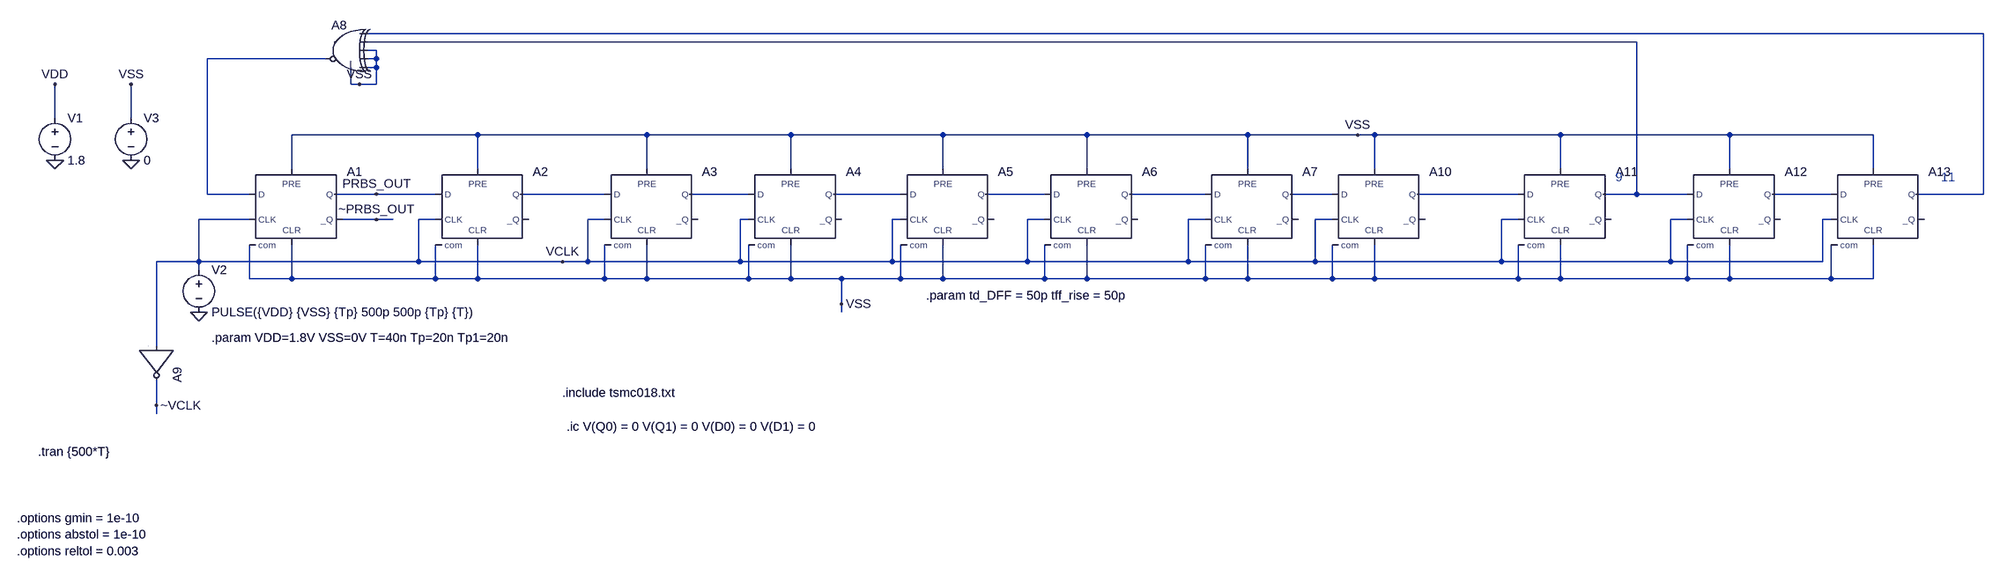
[diagram p0: schematic prbs11bit.asc]
prbs11bit.asc, the LTspice schematic file:
Version 4
SHEET 1 2628 680
WIRE 1504 -368 -1552 -368
WIRE 848 -352 -1552 -352
WIRE -1536 -336 -1552 -336
WIRE -1632 -320 -1856 -320
WIRE -1536 -320 -1536 -336
WIRE -1536 -320 -1552 -320
WIRE -1536 -304 -1536 -320
WIRE -1536 -304 -1552 -304
WIRE -1584 -272 -1584 -304
WIRE -1568 -272 -1584 -272
WIRE -1536 -272 -1536 -304
WIRE -1536 -272 -1568 -272
WIRE -2144 -208 -2144 -272
WIRE -2000 -208 -2000 -272
WIRE -1344 -176 -1696 -176
WIRE -1024 -176 -1344 -176
WIRE -752 -176 -1024 -176
WIRE -464 -176 -752 -176
WIRE -192 -176 -464 -176
WIRE 112 -176 -192 -176
WIRE 320 -176 112 -176
WIRE 352 -176 320 -176
WIRE 704 -176 352 -176
WIRE 1024 -176 704 -176
WIRE 1296 -176 1024 -176
WIRE -1696 -112 -1696 -176
WIRE -1344 -112 -1344 -176
WIRE -1024 -112 -1024 -176
WIRE -752 -112 -752 -176
WIRE -464 -112 -464 -176
WIRE -192 -112 -192 -176
WIRE 112 -112 112 -176
WIRE 352 -112 352 -176
WIRE 704 -112 704 -176
WIRE 1024 -112 1024 -176
WIRE 1296 -112 1296 -176
WIRE -1856 -64 -1856 -320
WIRE -1776 -64 -1856 -64
WIRE -1536 -64 -1616 -64
WIRE -1424 -64 -1536 -64
WIRE -1104 -64 -1264 -64
WIRE -832 -64 -944 -64
WIRE -544 -64 -672 -64
WIRE -272 -64 -384 -64
WIRE 32 -64 -112 -64
WIRE 272 -64 192 -64
WIRE 624 -64 432 -64
WIRE 848 -64 848 -352
WIRE 848 -64 784 -64
WIRE 944 -64 848 -64
WIRE 1216 -64 1104 -64
WIRE 1504 -64 1504 -368
WIRE 1504 -64 1376 -64
WIRE -1776 -16 -1872 -16
WIRE -1536 -16 -1600 -16
WIRE -1504 -16 -1536 -16
WIRE -1424 -16 -1456 -16
WIRE -1104 -16 -1136 -16
WIRE -832 -16 -848 -16
WIRE -544 -16 -560 -16
WIRE -272 -16 -304 -16
WIRE 32 -16 0 -16
WIRE 272 -16 240 -16
WIRE 624 -16 592 -16
WIRE 944 -16 912 -16
WIRE 1216 -16 1200 -16
WIRE -1872 64 -1872 -16
WIRE -1872 64 -1952 64
WIRE -1456 64 -1456 -16
WIRE -1456 64 -1872 64
WIRE -1184 64 -1456 64
WIRE -1136 64 -1136 -16
WIRE -1136 64 -1184 64
WIRE -848 64 -848 -16
WIRE -848 64 -1136 64
WIRE -560 64 -560 -16
WIRE -560 64 -848 64
WIRE -304 64 -304 -16
WIRE -304 64 -560 64
WIRE 0 64 0 -16
WIRE 0 64 -304 64
WIRE 240 64 240 -16
WIRE 240 64 0 64
WIRE 592 64 592 -16
WIRE 592 64 240 64
WIRE 912 64 912 -16
WIRE 912 64 592 64
WIRE 1200 64 1200 -16
WIRE 1200 64 912 64
WIRE -1872 80 -1872 64
WIRE -1776 96 -1776 32
WIRE -1696 96 -1696 32
WIRE -1696 96 -1776 96
WIRE -1424 96 -1424 32
WIRE -1424 96 -1696 96
WIRE -1344 96 -1344 32
WIRE -1344 96 -1424 96
WIRE -1104 96 -1104 32
WIRE -1104 96 -1344 96
WIRE -1024 96 -1024 32
WIRE -1024 96 -1104 96
WIRE -832 96 -832 32
WIRE -832 96 -1024 96
WIRE -752 96 -752 32
WIRE -752 96 -832 96
WIRE -656 96 -752 96
WIRE -544 96 -544 32
WIRE -544 96 -656 96
WIRE -464 96 -464 32
WIRE -464 96 -544 96
WIRE -272 96 -272 32
WIRE -272 96 -464 96
WIRE -192 96 -192 32
WIRE -192 96 -272 96
WIRE 32 96 32 32
WIRE 32 96 -192 96
WIRE 112 96 112 32
WIRE 112 96 32 96
WIRE 272 96 272 32
WIRE 272 96 112 96
WIRE 352 96 352 32
WIRE 352 96 272 96
WIRE 624 96 624 32
WIRE 624 96 352 96
WIRE 704 96 704 32
WIRE 704 96 624 96
WIRE 944 96 944 32
WIRE 944 96 704 96
WIRE 1024 96 1024 32
WIRE 1024 96 944 96
WIRE 1216 96 1216 32
WIRE 1216 96 1024 96
WIRE 1296 96 1296 32
WIRE 1296 96 1216 96
WIRE -656 144 -656 96
WIRE -656 160 -656 144
WIRE -1952 224 -1952 64
WIRE -1952 336 -1952 288
WIRE -1952 352 -1952 336
FLAG -2144 -128 0
FLAG -2144 -272 VDD
FLAG -1872 160 0
FLAG -1568 -272 VSS
FLAG -656 144 VSS
FLAG -1536 -64 PRBS_OUT
FLAG -1536 -16 ~PRBS_OUT
FLAG 320 -176 VSS
FLAG -1184 64 VCLK
FLAG -1952 336 ~VCLK
FLAG -2000 -128 0
FLAG -2000 -272 VSS
SYMBOL voltage -2144 -224 R0
WINDOW 123 0 0 Left 0
WINDOW 39 0 0 Left 0
SYMATTR InstName V1
SYMATTR Value 1.8
SYMBOL Digital\\dflop -1696 -112 R0
SYMATTR InstName A1
SYMATTR SpiceLine Trise = {tff_rise} Tfall = {tff_rise} Td = {td_DFF}
SYMATTR Value2 Vhigh = 1.8 Vlow = 0
SYMBOL Digital\\dflop -1344 -112 R0
SYMATTR InstName A2
SYMATTR SpiceLine Trise = {tff_rise} Tfall = {tff_rise} Td = {td_DFF}
SYMATTR Value2 Vhigh = 1.8 Vlow = 0
SYMBOL Digital\\dflop -1024 -112 R0
SYMATTR InstName A3
SYMATTR SpiceLine Trise = {tff_rise} Tfall = {tff_rise} Td = {td_DFF}
SYMATTR Value2 Vhigh = 1.8 Vlow = 0
SYMBOL Digital\\dflop -752 -112 R0
SYMATTR InstName A4
SYMATTR SpiceLine Trise = {tff_rise} Tfall = {tff_rise} Td = {td_DFF}
SYMATTR Value2 Vhigh = 1.8 Vlow = 0
SYMBOL Digital\\dflop -464 -112 R0
SYMATTR InstName A5
SYMATTR SpiceLine Trise = {tff_rise} Tfall = {tff_rise} Td = {td_DFF}
SYMATTR Value2 Vhigh = 1.8 Vlow = 0
SYMBOL Digital\\dflop -192 -112 R0
SYMATTR InstName A6
SYMATTR SpiceLine Trise = {tff_rise} Tfall = {tff_rise} Td = {td_DFF}
SYMATTR Value2 Vhigh = 1.8 Vlow = 0
SYMBOL Digital\\dflop 112 -112 R0
SYMATTR InstName A7
SYMATTR SpiceLine Trise = {tff_rise} Tfall = {tff_rise} Td = {td_DFF}
SYMATTR Value2 Vhigh = 1.8 Vlow = 0
SYMBOL Digital\\xor -1600 -400 M0
SYMATTR InstName A8
SYMATTR Value2 Vhigh = 1.8 Vlow = 0
SYMATTR SpiceLine Trise = {tff_rise} Tfall = {tff_rise} Td = {td_DFF}
SYMBOL voltage -1872 64 R0
WINDOW 123 0 0 Left 0
WINDOW 39 0 0 Left 0
SYMATTR InstName V2
SYMATTR Value PULSE({VDD} {VSS} {Tp} 500p 500p {Tp} {T})
SYMBOL Digital\\inv -1888 224 R90
SYMATTR InstName A9
SYMATTR Value2 Vhigh = 1.8 Vlow = 0
SYMATTR SpiceLine Trise = {tff_rise} Tfall = {tff_rise} Td = {td_DFF}
SYMBOL voltage -2000 -224 R0
WINDOW 123 0 0 Left 0
WINDOW 39 0 0 Left 0
SYMATTR InstName V3
SYMATTR Value 0
SYMBOL Digital\\dflop 352 -112 R0
SYMATTR InstName A10
SYMATTR SpiceLine Trise = {tff_rise} Tfall = {tff_rise} Td = {td_DFF}
SYMATTR Value2 Vhigh = 1.8 Vlow = 0
SYMBOL Digital\\dflop 704 -112 R0
SYMATTR InstName A11
SYMATTR SpiceLine Trise = {tff_rise} Tfall = {tff_rise} Td = {td_DFF}
SYMATTR Value2 Vhigh = 1.8 Vlow = 0
SYMBOL Digital\\dflop 1024 -112 R0
SYMATTR InstName A12
SYMATTR SpiceLine Trise = {tff_rise} Tfall = {tff_rise} Td = {td_DFF}
SYMATTR Value2 Vhigh = 1.8 Vlow = 0
SYMBOL Digital\\dflop 1296 -112 R0
SYMATTR InstName A13
SYMATTR SpiceLine Trise = {tff_rise} Tfall = {tff_rise} Td = {td_DFF}
SYMATTR Value2 Vhigh = 1.8 Vlow = 0
TEXT -1184 312 Left 2 !.include tsmc018.txt
TEXT -496 128 Left 2 !.param td_DFF = 50p tff_rise = 50p
TEXT -1848 208 Left 2 !.param VDD=1.8V VSS=0V T=40n Tp=20n Tp1=20n
TEXT -2176 424 Left 2 !.tran {500*T}
TEXT -2216 568 Left 2 !.options gmin = 1e-10\n.options abstol = 1e-10\n.options reltol = 0.003
TEXT -1176 376 Left 2 !.ic V(Q0) = 0 V(Q1) = 0 V(D0) = 0 V(D1) = 0
TEXT 1424 -96 Left 2 ;11
TEXT 808 -96 Left 2 ;9

The netlist it stands for:
* prbs11bit.asc
V1 VDD 0 1.8
A1 N003 VSS VCLK VSS VSS ~PRBS_OUT PRBS_OUT VSS DFLOP Vhigh = 1.8 Vlow = 0 Trise = {tff_rise} Tfall = {tff_rise} Td = {td_DFF}
A2 PRBS_OUT VSS VCLK VSS VSS VSS N004 VSS DFLOP Vhigh = 1.8 Vlow = 0 Trise = {tff_rise} Tfall = {tff_rise} Td = {td_DFF}
A3 N004 VSS VCLK VSS VSS VSS N005 VSS DFLOP Vhigh = 1.8 Vlow = 0 Trise = {tff_rise} Tfall = {tff_rise} Td = {td_DFF}
A4 N005 VSS VCLK VSS VSS VSS N006 VSS DFLOP Vhigh = 1.8 Vlow = 0 Trise = {tff_rise} Tfall = {tff_rise} Td = {td_DFF}
A5 N006 VSS VCLK VSS VSS VSS N007 VSS DFLOP Vhigh = 1.8 Vlow = 0 Trise = {tff_rise} Tfall = {tff_rise} Td = {td_DFF}
A6 N007 VSS VCLK VSS VSS VSS N008 VSS DFLOP Vhigh = 1.8 Vlow = 0 Trise = {tff_rise} Tfall = {tff_rise} Td = {td_DFF}
A7 N008 VSS VCLK VSS VSS VSS N009 VSS DFLOP Vhigh = 1.8 Vlow = 0 Trise = {tff_rise} Tfall = {tff_rise} Td = {td_DFF}
A8 N001 N002 VSS VSS VSS N003 VSS VSS XOR Vhigh = 1.8 Vlow = 0 Trise = {tff_rise} Tfall = {tff_rise} Td = {td_DFF}
V2 VCLK 0 PULSE({VDD} {VSS} {Tp} 500p 500p {Tp} {T})
A9 VCLK 0 0 0 0 ~VCLK 0 0 BUF Vhigh = 1.8 Vlow = 0 Trise = {tff_rise} Tfall = {tff_rise} Td = {td_DFF}
V3 VSS 0 0
A10 N009 VSS VCLK VSS VSS VSS N010 VSS DFLOP Vhigh = 1.8 Vlow = 0 Trise = {tff_rise} Tfall = {tff_rise} Td = {td_DFF}
A11 N010 VSS VCLK VSS VSS VSS N002 VSS DFLOP Vhigh = 1.8 Vlow = 0 Trise = {tff_rise} Tfall = {tff_rise} Td = {td_DFF}
A12 N002 VSS VCLK VSS VSS VSS N011 VSS DFLOP Vhigh = 1.8 Vlow = 0 Trise = {tff_rise} Tfall = {tff_rise} Td = {td_DFF}
A13 N011 VSS VCLK VSS VSS VSS N001 VSS DFLOP Vhigh = 1.8 Vlow = 0 Trise = {tff_rise} Tfall = {tff_rise} Td = {td_DFF}
.include tsmc018.txt
.param td_DFF = 50p tff_rise = 50p
.param VDD=1.8V VSS=0V T=40n Tp=20n Tp1=20n
.tran {500*T}
.options gmin = 1e-10
.options abstol = 1e-10
.options reltol = 0.003
.ic V(Q0) = 0 V(Q1) = 0 V(D0) = 0 V(D1) = 0
* 11
* 9
.backanno
.end